# EAGLE schematic tlc5940-arduino (EAGLE 6.2)
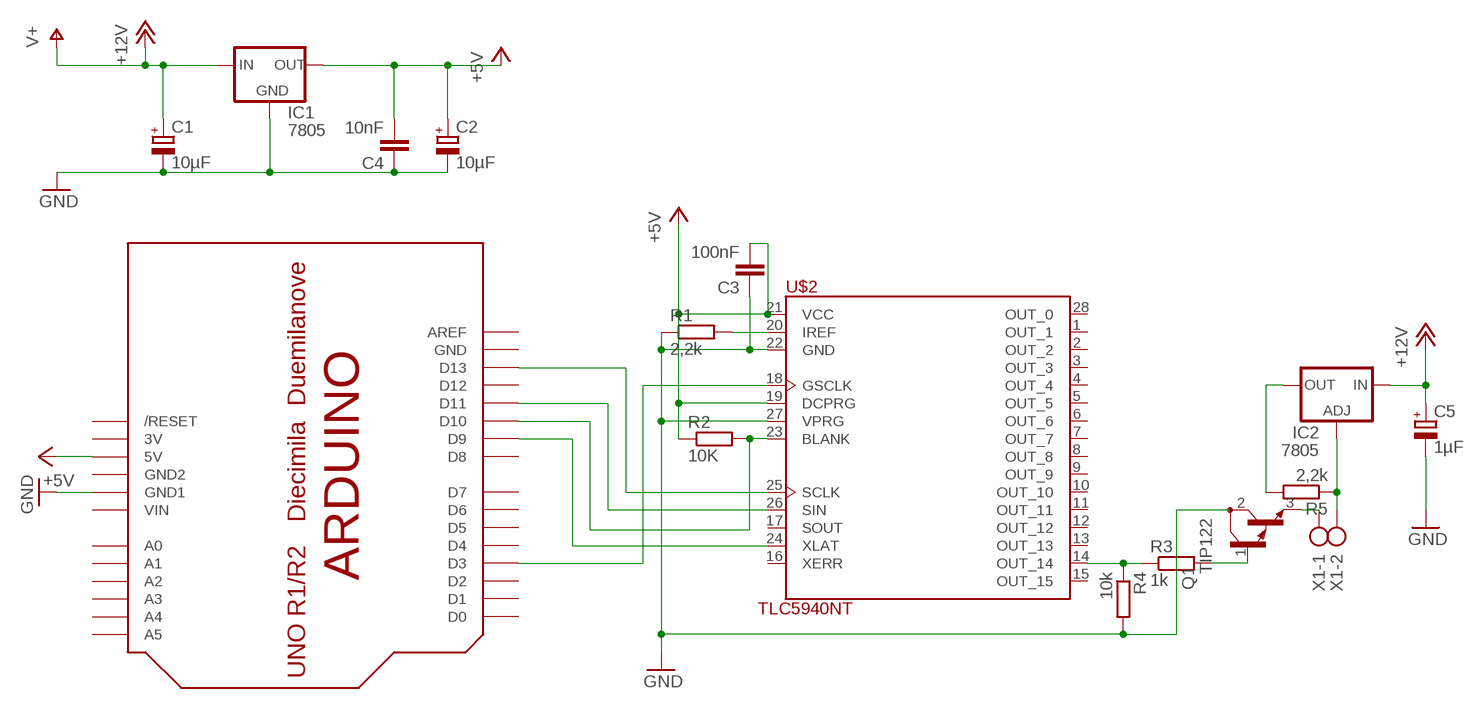
[diagram p0: schematic, sheet 1]

## Parts
C1  10µF  CPOL-EUE2.5-6  [E2,5-6]
C2  10µF  CPOL-EUE2.5-6  [E2,5-6]
C3  100nF  C-EU050-030X075  [C050-030X075]
C4  10nF  C-EU050-030X075  [C050-030X075]
C5  1µF  CPOL-EUE2.5-6  [E2,5-6]
IC1  7805  78XXS  [78XXS]
IC2  7805  LM317TS  [317TS]
Q1  TIP122  [TO220]
R1  2,2k  R-EU_0207/10  [0207/10]
R2  10K  R-EU_0207/10  [0207/10]
R3  1k  R-EU_0207/10  [0207/10]
R4  10k  R-EU_0207/10  [0207/10]
R5  2,2k  R-EU_0207/10  [0207/10]
U$1  ARDUINOUNO  [ARDUINO]
U$2  TLC5940NT  [DIP-28]
X1  AK500/2  [AK500/2]

## Nets
+5V: C2.+ C3.2 C4.2 IC1.OUT R2.1 U$1.5V U$2.19(DCPRG) U$2.21(VCC)
+12V: C1.+ C5.+ IC1.IN IC2.3(IN) ; supply symbol labelled V+
GND: C1.- C2.- C3.1 C4.1 C5.- IC1.GND Q1.2(C) R1.1 R4.2 U$1.GND1 U$2.22(GND) U$2.27(VPRG)
N$1: U$1.D13 U$2.25(SCLK)
N$2: U$1.D11 U$2.26(SIN)
N$3: R2.2 U$1.D10 U$2.23(BLANK)
N$4: U$1.D9 U$2.24(XLAT)
N$5: U$1.D3 U$2.18(GSCLK)
N$6: R3.1 R4.1 U$2.14(OUT_14)
N$7: R1.2 U$2.20(IREF)
N$8: Q1.1(B) R3.2
N$9: IC2.1(ADJ) R5.1 X1.2
N$10: IC2.2(OUT) R5.2
N$11: Q1.3(E) X1.1
Unconnected: U$1.A0 U$1.A1 U$1.A2 U$1.A3 U$1.A4 U$1.A5 U$1.AREF U$1.D0 U$1.D1 U$1.D2 U$1.D4 U$1.D5 U$1.D6 U$1.D7 U$1.D8 U$1.D12 U$1.RESET(/RESET) U$2.1(OUT_1) U$2.2(OUT_2) U$2.3(OUT_3) U$2.4(OUT_4) U$2.5(OUT_5) U$2.6(OUT_6) U$2.7(OUT_7) U$2.8(OUT_8) U$2.9(OUT_9) U$2.10(OUT_10) U$2.11(OUT_11) U$2.12(OUT_12) U$2.13(OUT_13) U$2.15(OUT_15) U$2.16(XERR) U$2.17(SOUT) U$2.28(OUT_0)

## Power pins joined to a net without a drawn wire
3V: U$1.3V
GND: U$1.GND
GND2: U$1.GND2
VIN: U$1.VIN

## Library data of the parts
C1 C2 C5 = rcl:CPOL-EU: POLARIZED CAPACITOR, European symbol
C3 C4 = rcl:C-EU: CAPACITOR, European symbol
IC1 = v-reg:78XXS: VOLTAGE REGULATOR
IC2 = v-reg:LM317TS: VOLTAGE REGULATOR
Q1 = transistor-npn:TIP122*: NPN Darlington Transistor
R1-R5 = rcl:R-EU_: RESISTOR, European symbol
U$1 = adafruit:ARDUINO: Arduino Diecimila/Duemilanove Make a shield with ease, this package has all the named pins as well as the two mounting drill holes and an outline of the USB and DC power connector. The outline is on the DIMENSION layer, so if your board house uses it they will cut the outline to match. http://www.ladyada.net/library/pcb/eaglelibrary.html
U$2 = tlc5940:TLC5940
X1 = con-ptr500:AK500/2: CONNECTOR; OC_FARNELL: unknown; OC_NEWARK: unknown